# Altium schematic sheet Connectors.SchDoc
size A4; SheetNumber: 3; SheetTotal: 4
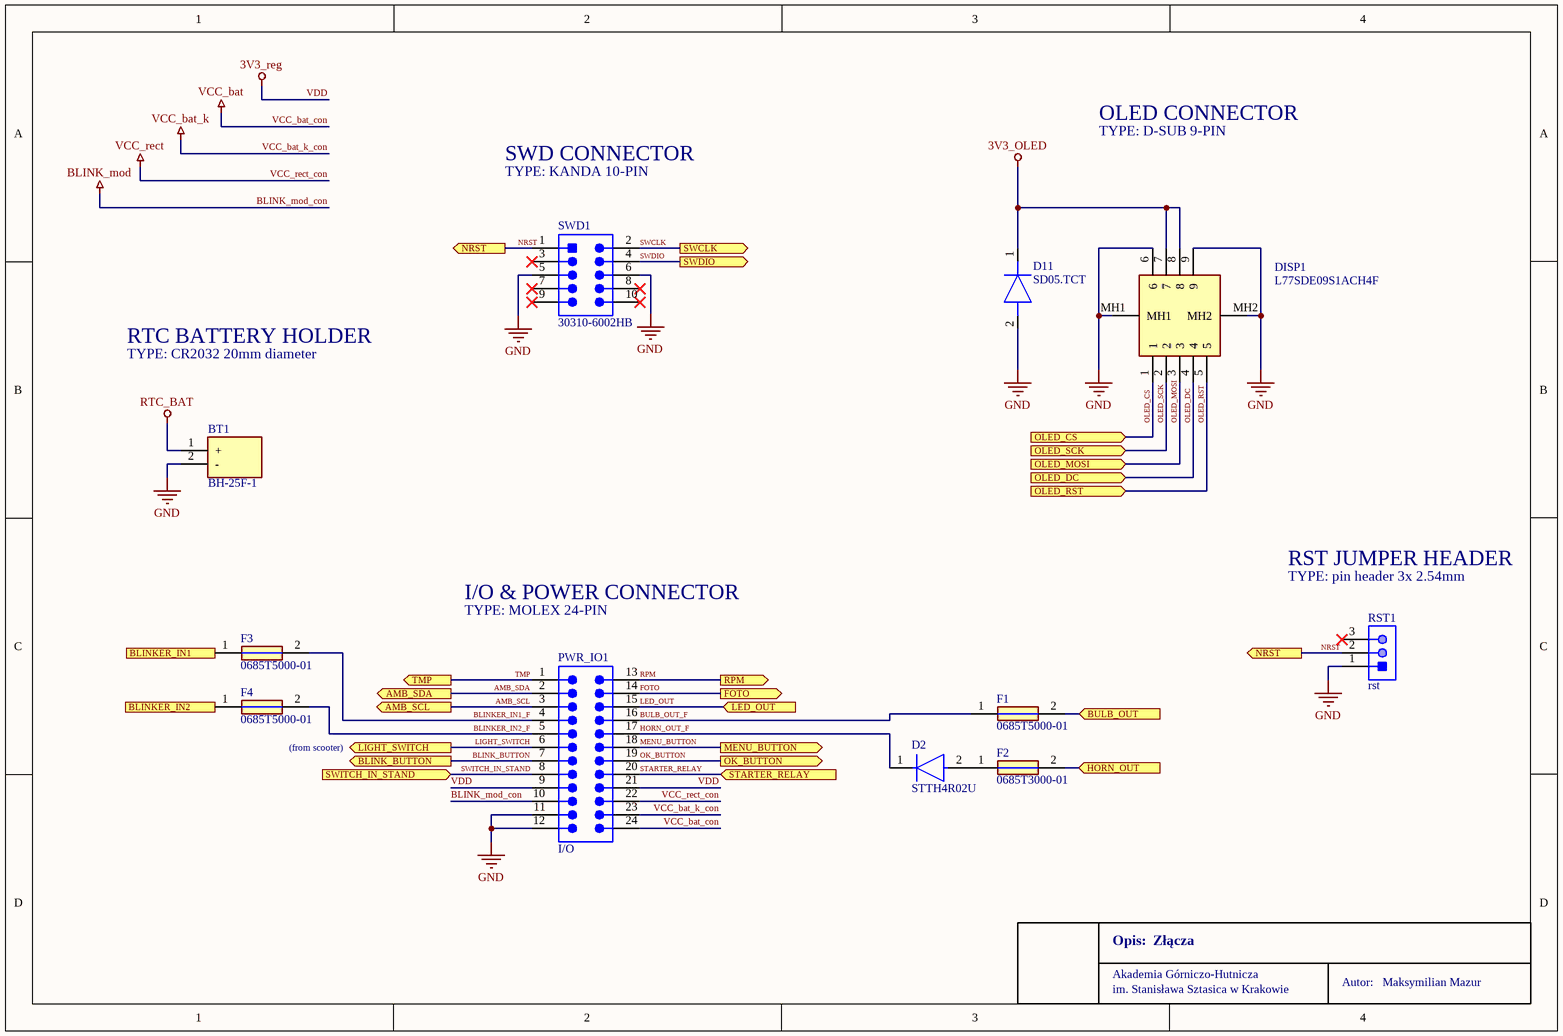
[diagram p0: Connectors.SchDoc]

## Parts
BT1  BH-25F-1  [BH25F1]
D2  STTH4R02U  [FP-SMB-MFG]
D11  SD05.TCT  [SOD2513X110N]
DISP1  L77SDE09S1ACH4F  [L77SDE09S1ACH4F]
F1  0685T5000-01  [FUSC3216X83N]
F2  0685T3000-01  [FUSC3216X83N]
F3  0685T5000-01  [FUSC3216X83N]
F4  0685T5000-01  [FUSC3216X83N]
PWR_IO1  I/O  [649024227222]
RST1  rst  [MOLX-22-28-4033_V]
SWD1  30310-6002HB  [3M-30310-6002HB-10_V]

## Ports
AMB_SCL (out, see Buffers[4B]), AMB_SDA (out, see Buffers[4A]), BLINK_BUTTON (out, see Buffers[4D]), BLINKER_IN1 (out, see MPU[1C]), BLINKER_IN2 (out, see MPU[2C]), BULB_OUT (in, see MPU[2C]), FOTO (out, see Buffers[1B]), HORN_OUT (in, see MPU[2D]), LED_OUT (in, see MPU[2C]), LIGHT_SWITCH (out, see MPU[2B]), MENU_BUTTON (out, see Buffers[4C]), NRST (out, see Connectors[2A], MPU[5C]), NRST (out, see Connectors[4C], MPU[5C]), OK_BUTTON (out, see Buffers[4C]), OLED_CS (in, see MPU[5D]), OLED_DC (in, see MPU[5D]), OLED_MOSI (in, see MPU[5D]), OLED_RST (in, see MPU[5D]), OLED_SCK (in, see MPU[5D]), RPM (out, see Buffers[1D]), STARTER_RELAY (in, see MPU[2C]), SWCLK (out, see MPU[6B]), SWDIO (out, see MPU[7B]), SWITCH_IN_STAND (in, see MPU[2C]), TMP (out, see Buffers[1A])

## Nets
3V3_OLED: D11.1(K) DISP1.7 DISP1.8
BLINK_mod_con: PWR_IO1.10  [also labelled BLINK_mod]
GND: BT1.2(-) D11.2(A) DISP1.6 DISP1.9 DISP1.MH1 DISP1.MH2 PWR_IO1.11 PWR_IO1.12 RST1.1 SWD1.5 SWD1.6
RTC_BAT: BT1.1(+)
VCC_bat_con: PWR_IO1.24  [also labelled VCC_bat]
VCC_bat_k_con: PWR_IO1.23  [also labelled VCC_bat_k]
VCC_rect_con: PWR_IO1.22  [also labelled VCC_rect]
VDD: PWR_IO1.9 PWR_IO1.21  [also labelled 3V3_reg]
AMB_SCL: PWR_IO1.3 ; port AMB_SCL
AMB_SDA: PWR_IO1.2 ; port AMB_SDA
BLINK_BUTTON: PWR_IO1.7 ; port BLINK_BUTTON
BLINKER_IN1: F3.1 ; port BLINKER_IN1
BLINKER_IN1_F: F3.2 PWR_IO1.4
BLINKER_IN2: F4.1 ; port BLINKER_IN2
BLINKER_IN2_F: F4.2 PWR_IO1.5
BULB_OUT: F1.2 ; port BULB_OUT
BULB_OUT_F: F1.1 PWR_IO1.16
FOTO: PWR_IO1.14 ; port FOTO
HORN_OUT: F2.2 ; port HORN_OUT
HORN_OUT_F: D2.1(K) PWR_IO1.17
LED_OUT: PWR_IO1.15 ; port LED_OUT
LIGHT_SWITCH: PWR_IO1.6 ; port LIGHT_SWITCH
MENU_BUTTON: PWR_IO1.18 ; port MENU_BUTTON
NRST: RST1.2 SWD1.1 ; port NRST
OK_BUTTON: PWR_IO1.19 ; port OK_BUTTON
OLED_CS: DISP1.1 ; port OLED_CS
OLED_DC: DISP1.4 ; port OLED_DC
OLED_MOSI: DISP1.3 ; port OLED_MOSI
OLED_RST: DISP1.5 ; port OLED_RST
OLED_SCK: DISP1.2 ; port OLED_SCK
RPM: PWR_IO1.13 ; port RPM
STARTER_RELAY: PWR_IO1.20 ; port STARTER_RELAY
SWCLK: SWD1.2 ; port SWCLK
SWDIO: SWD1.4 ; port SWDIO
SWITCH_IN_STAND: PWR_IO1.8 ; port SWITCH_IN_STAND
TMP: PWR_IO1.1 ; port TMP
NetD2_2: D2.2(A) F2.1

Not connected (* = marked no-connect by the designer): RST1 3*; SWD1 3* 7* 8* 9* 10*

## Notes on the sheet
- SWD CONNECTOR
- TYPE: KANDA 10-PIN
- OLED CONNECTOR
- TYPE: D-SUB 9-PIN
- RTC BATTERY HOLDER
- TYPE: CR2032 20mm diameter
- RST JUMPER HEADER
- TYPE: pin header 3x 2.54mm
- I/O & POWER CONNECTOR
- TYPE: MOLEX 24-PIN
- (near F4) (from scooter)
- Akademia Górniczo-Hutnicza
- Opis:
- Złącza
- Autor:
- Maksymilian Mazur
- im. Stanisława Sztasica w Krakowie

## Library data of the parts
BT1 = BH-25F-1: Battery; Manufacturer_Name: Adam Tech; Datasheet Link: https://app.adam-tech.com/products/download/data_sheet/196966/bh-25f-1-data-sheet.pdf; Height: 9.5mm; Manufacturer_Part_Number: BH-25F-1; Mouser Part Number: 737-BH-25F-1; Mouser Price/Stock: https://www.mouser.co.uk/ProductDetail/Adam-Tech/BH-25F-1?qs=HoCaDK9Nz5dcCnxRauSciw%3D%3D; Arrow Part Number: BH-25F-1; Arrow Price/Stock: https://www.arrow.com/en/products/bh-25f-1/adam-tech?utm_currency=USD&region=europe
D2 = CMP-12188-000005-1: DIODE GEN PURP 200V 4A SMB; Manufacturer: STMicroelectronics; Peak Reverse Current: 3uA; Standoff Height: 0.05mm; Max Junction Temp: +175°C; Max Surge Forward Current: 70A; Forward Current: 4A; Manufacturer Part Number: STTH4R02U; Device Class L3: Rectifier Diodes; Package: SMB; Lead Free: Yes; Category: Diode; Height: 2.65mm; Digikey Description: DIODE GEN PURP 200V 4A SMB; Temperature: to +175°C; Mouser Description: Rectifiers RECTIFIER; ComponentLink2URL: https://www.st.com/resource/en/datasheet/stth4r02.pdf; ComponentLink2Description: Datasheet; Max Repetitive Reverse Voltage: 200V; Device Class L2: Diodes; Temperature Range High: +175°C; Device Class L1: Discrete Semiconductors; RoHS: TRUE; Octopart: https://octopart.com/stth4r02u-stmicroelectronics-324581; Automotive: No
D11 = SD05.TCT: Diode; Manufacturer_Name: SEMTECH; Datasheet Link: https://datasheet.datasheetarchive.com/originals/distributors/Datasheets-DGA26/1841681.pdf; Height: 1.1mm; Manufacturer_Part_Number: SD05.TCT; Mouser Part Number: 947-SD05.TCT; Mouser Price/Stock: https://www.mouser.co.uk/ProductDetail/Semtech/SD05.TCT?qs=rBWM4%252BvDhIed78qt1y4o0Q%3D%3D; Arrow Part Number: SD05.TCT; Arrow Price/Stock: https://www.arrow.com/en/products/sd05.tct/semtech?utm_currency=USD&region=nac
DISP1 = L77SDE09S1ACH4F: Connector; Manufacturer_Name: Amphenol Communications Solutions; Datasheet Link: https://cdn.amphenol-cs.com/media/wysiwyg/files/drawing/l77sdxxxs1ach4f.pdf; Height: 12.93mm; Manufacturer_Part_Number: L77SDE09S1ACH4F; Mouser Part Number: 523-L77SDE09S1ACH4F; Mouser Price/Stock: https://www.mouser.com/Search/Refine.aspx?Keyword=523-L77SDE09S1ACH4F
F1 F3 F4 = 0685T3000-01: Fuse 5A / 63VAC/63VDC / 1206; Manufacturer_Name: BelFuse; Datasheet Link: https://www.belfuse.com/resources/datasheets/circuitprotection/ds-cp-c1t-series.pdf; Height: 0.83mm; Manufacturer_Part_Number: 0685T3000-01; Arrow Part Number: 0685T3000-01; Arrow Price/Stock: https://www.arrow.com/en/products/0685t3000-01/bel-group
F2 = 0685T3000-01: Fuse 3A / 63VAC/63VDC / 1206; Manufacturer_Name: BelFuse; Datasheet Link: https://www.belfuse.com/resources/datasheets/circuitprotection/ds-cp-c1t-series.pdf; Height: 0.83mm; Manufacturer_Part_Number: 0685T3000-01; Arrow Part Number: 0685T3000-01; Arrow Price/Stock: https://www.arrow.com/en/products/0685t3000-01/bel-group
PWR_IO1 = CMP-1502-00539-2: NexarPartId: 23024662; Pitch: 4.2mm; Number of Contacts: 24; Operating Supply Voltage: 600V; Contact Resistance: 10mΩ; Row Spacing: 4.191mm; Current Rating: 6A; Connector Type: Male Pin, Socket; Insulation Resistance: 1GΩ; Gender: Male; Contact Plating: Tin; Max Operating Temperature: 105°C; Length: 51.6mm; Color: White; Termination: Solder; Number of Pins: 24; Lead Pitch: 4.2mm; Number of Positions: 24; REACH SVHC: Unknown; Contact Material: Copper; Fastening Type: Ramp; Number of Rows: 2; Height: 12.8mm; Min Operating Temperature: -40°C; RoHS: Compliant; Mount: Through Hole; Width: 51.7mm
RST1 = CMP-1676-00001-5: Male Header, Pitch 2.54 mm, 1 x 3 Position, Height 8.38 mm, Tail Length 3.18 mm, RoHS, Bulk; Manufacturer: Molex; Rows: 1; Voltage Rating: 250 V; Current Rating: 4 A; Min Operating Temperature: 0 degC; Lead Pitch: 0.1 inch; Packaging: Bulk; Contact Finish: Gold; RoHSCompliant: true; Contact Material: Brass; PackageReference: 22-28-4033; REACH SVHC: Unknown; PackageDescription: Male Header, Pitch 2.54 mm, 1 x 3 Position, Height 8.38 mm, Tail Length 3.18 mm; ComponentLink2URL: http://www.molex.com/pdm_docs/sd/022284033_sd.pdf; Height: 8.38 mm; Mounting Technology: Through Hole; ComponentLink1Description: Manufacturer URL; Length: 7.62 mm; Mount: Through Hole; DatasheetVersion: Rev. G, 01/2012; Max Operating Temperature: 75 degC; ComponentLink2Description: Datasheet; Colour: Black; Pins: 3; Contact Plating: Gold; Package Quantity: 1; ComponentLink1URL: http://www.molex.com/
SWD1 = CMP-2000-05031-1: Male Header, Pitch 2.54 mm, 2 x 5 Position, Height 9.3 mm, Tail Length 2.79 mm, -55 to 105 degC, RoHS, Bulk; Manufacturer: 3M; Current Rating: 1A; Brand: 3MElectronicSolutionsDivision; Mounting Angle: Straight; Number of Positions: 10Position; Mating Post Length: 5.99mm; Pitch: 2.54mm; Manufacturer URL: http://www.3m.com/; Factory Pack Quantity: 1000; Mounting Style: StraightPin; Number of Rows: 2Row; Termination Post Length: 2.79mm; Contact Gender: Pin(Male); Contact Material: Brass; Termination Style: ThroughHole; Product: Headers; Packaging: Tray; Product Category: Headers&WireHousings; Type: Shrouded; Datasheet URL: http://datasheet.octopart.com/30310-6002HB-3M-datasheet-11537585.pdf; Datasheet Version: Apr-12; Contact Plating: Gold; Row Spacing: 2.54mm; Housing Material: Polyester; Series: 303; RoHS: Details